# EAGLE design Button_Sequencer_single (EAGLE 9.3.0)
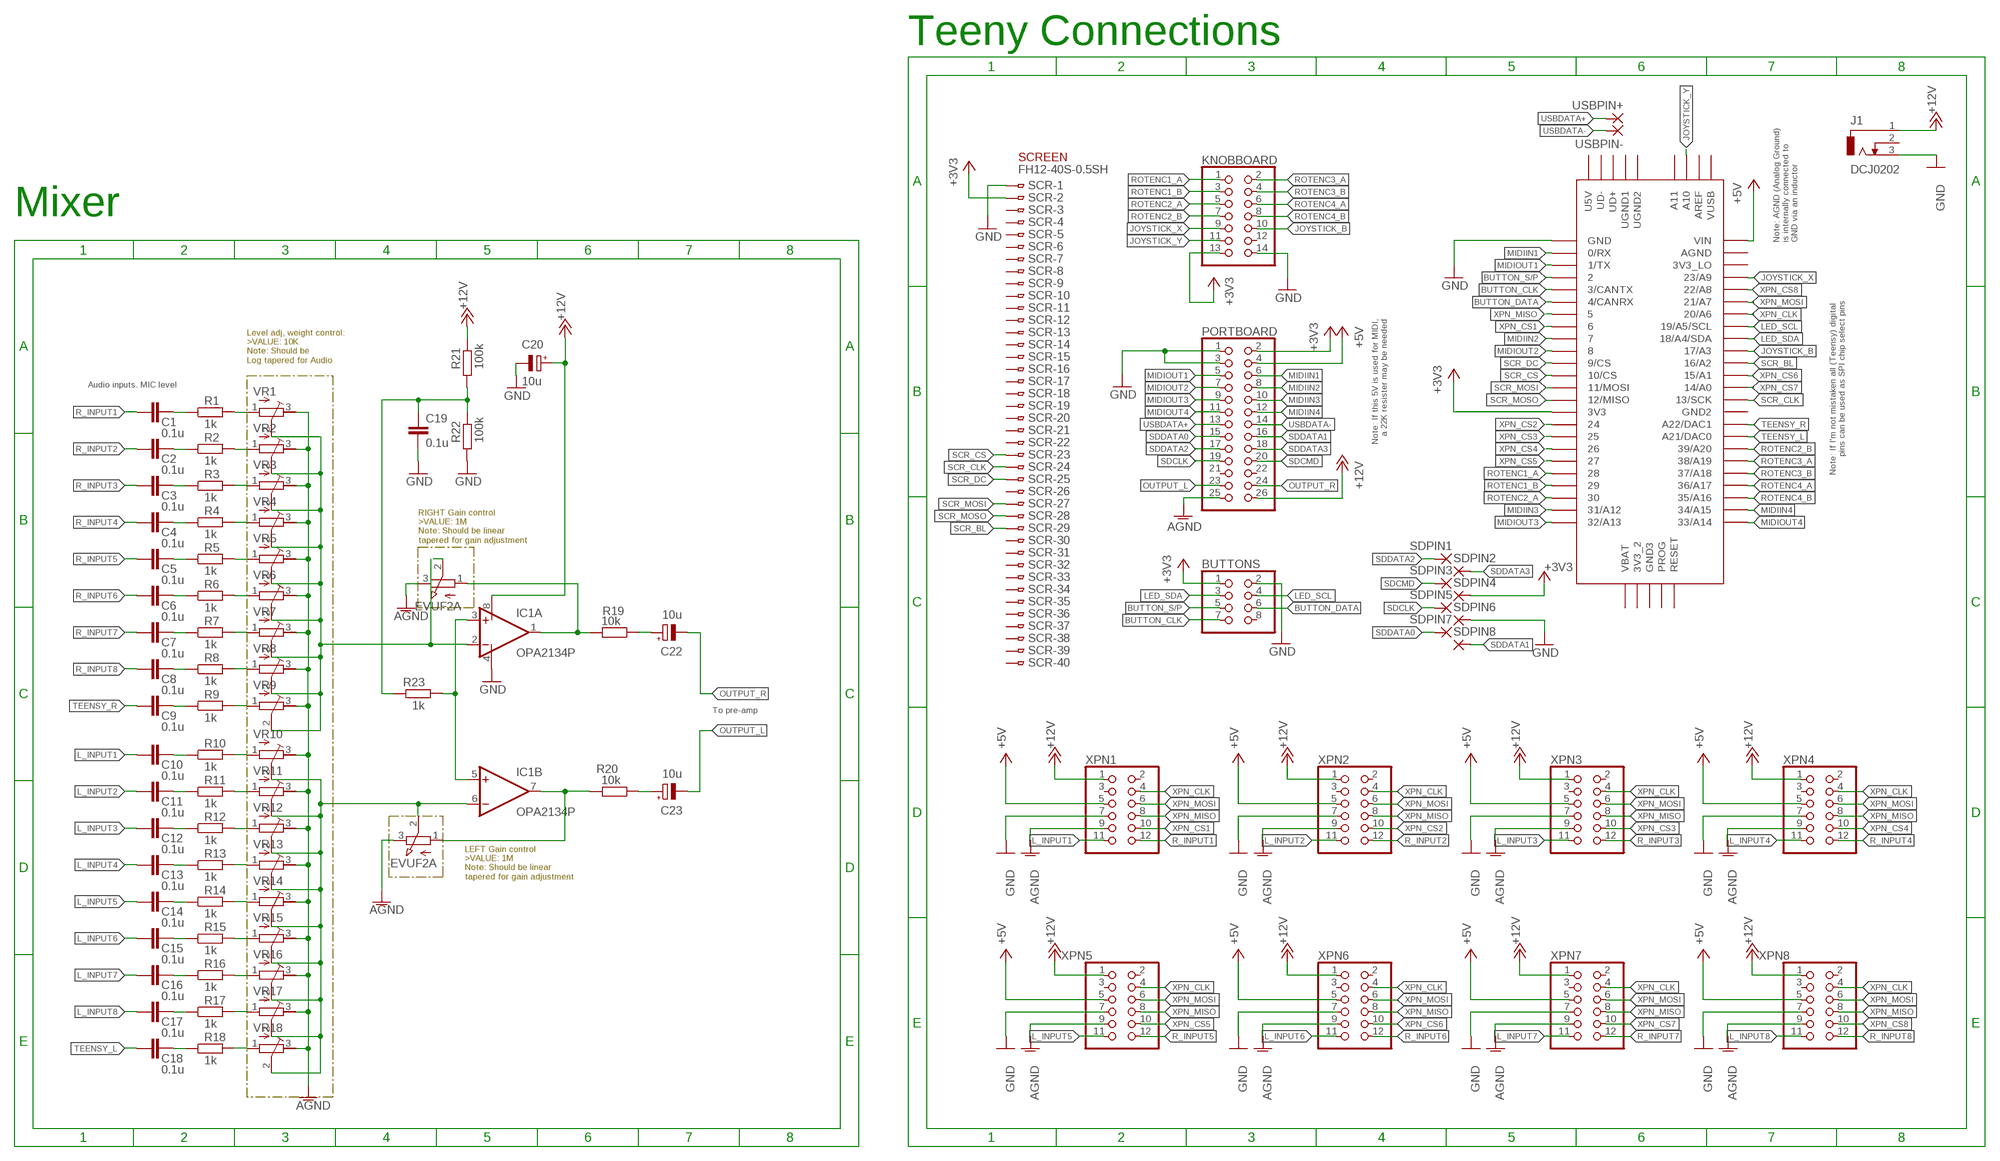
[diagram p0: schematic, sheet 1]

## Parts
BUTTONS  PINHD-2X4  [2X04]
C1  0.1u  C-EU025-030X050  [C025-030X050]
C2  0.1u  C-EU025-030X050  [C025-030X050]
C3  0.1u  C-EU025-030X050  [C025-030X050]
C4  0.1u  C-EU025-030X050  [C025-030X050]
C5  0.1u  C-EU025-030X050  [C025-030X050]
C6  0.1u  C-EU025-030X050  [C025-030X050]
C7  0.1u  C-EU025-030X050  [C025-030X050]
C8  0.1u  C-EU025-030X050  [C025-030X050]
C9  0.1u  C-EU025-030X050  [C025-030X050]
C10  0.1u  C-EU025-030X050  [C025-030X050]
C11  0.1u  C-EU025-030X050  [C025-030X050]
C12  0.1u  C-EU025-030X050  [C025-030X050]
C13  0.1u  C-EU025-030X050  [C025-030X050]
C14  0.1u  C-EU025-030X050  [C025-030X050]
C15  0.1u  C-EU025-030X050  [C025-030X050]
C16  0.1u  C-EU025-030X050  [C025-030X050]
C17  0.1u  C-EU025-030X050  [C025-030X050]
C18  0.1u  C-EU025-030X050  [C025-030X050]
C19  0.1u  C-EUC0805  [C0805]
C20  10u  CPOL-EUE5-10.5  [E5-10,5]
C22  10u  CPOL-EUE5-10.5  [E5-10,5]
C23  10u  CPOL-EUE5-10.5  [E5-10,5]
IC1  OPA2134P  [DIL08]
J1  DCJ0202  [DCJ0202]
KNOBBOARD  PINHD-2X7  [2X07]
PORTBOARD  PINHD-2X13  [2X13]
R1  1k  R-EU_R0805  [R0805]
R2  1k  R-EU_R0805  [R0805]
R3  1k  R-EU_R0805  [R0805]
R4  1k  R-EU_R0805  [R0805]
R5  1k  R-EU_R0805  [R0805]
R6  1k  R-EU_R0805  [R0805]
R7  1k  R-EU_R0805  [R0805]
R8  1k  R-EU_R0805  [R0805]
R9  1k  R-EU_R0805  [R0805]
R10  1k  R-EU_R0805  [R0805]
R11  1k  R-EU_R0805  [R0805]
R12  1k  R-EU_R0805  [R0805]
R13  1k  R-EU_R0805  [R0805]
R14  1k  R-EU_R0805  [R0805]
R15  1k  R-EU_R0805  [R0805]
R16  1k  R-EU_R0805  [R0805]
R17  1k  R-EU_R0805  [R0805]
R18  1k  R-EU_R0805  [R0805]
R19  10k  R-EU_R0805  [R0805]
R20  10k  R-EU_R0805  [R0805]
R21  100k  R-EU_R0805  [R0805]
R22  100k  R-EU_R0805  [R0805]
R23  1k  R-EU_R0805  [R0805]
SCR  FH12-40S-0.5SH  [FH12-40S-0.5SH]
SDPIN1  1,6/0,8  [1,6/0,8]
SDPIN2  1,6/0,8  [1,6/0,8]
SDPIN3  1,6/0,8  [1,6/0,8]
SDPIN4  1,6/0,8  [1,6/0,8]
SDPIN5  1,6/0,8  [1,6/0,8]
SDPIN6  1,6/0,8  [1,6/0,8]
SDPIN7  1,6/0,8  [1,6/0,8]
SDPIN8  1,6/0,8  [1,6/0,8]
TEENSY_3.6  TEENSY_3.5/3.6  [TEENSY_3.5/3.6]
USBPIN+  1,6/0,8  [1,6/0,8]
USBPIN-  1,6/0,8  [1,6/0,8]
VR1  R-TRIMM3339P  [RTRIM3339P]
VR2  R-TRIMM3339P  [RTRIM3339P]
VR3  R-TRIMM3339P  [RTRIM3339P]
VR4  R-TRIMM3339P  [RTRIM3339P]
VR5  R-TRIMM3339P  [RTRIM3339P]
VR6  R-TRIMM3339P  [RTRIM3339P]
VR7  R-TRIMM3339P  [RTRIM3339P]
VR8  R-TRIMM3339P  [RTRIM3339P]
VR9  R-TRIMM3339P  [RTRIM3339P]
VR10  R-TRIMM3339P  [RTRIM3339P]
VR11  R-TRIMM3339P  [RTRIM3339P]
VR12  R-TRIMM3339P  [RTRIM3339P]
VR13  R-TRIMM3339P  [RTRIM3339P]
VR14  R-TRIMM3339P  [RTRIM3339P]
VR15  R-TRIMM3339P  [RTRIM3339P]
VR16  R-TRIMM3339P  [RTRIM3339P]
VR17  R-TRIMM3339P  [RTRIM3339P]
VR18  R-TRIMM3339P  [RTRIM3339P]
VR19  EVUF2A  [EVUF]
VR20  EVUF2A  [EVUF]
XPN1  PINHD-2X6  [2X06]
XPN2  PINHD-2X6  [2X06]
XPN3  PINHD-2X6  [2X06]
XPN4  PINHD-2X6  [2X06]
XPN5  PINHD-2X6  [2X06]
XPN6  PINHD-2X6  [2X06]
XPN7  PINHD-2X6  [2X06]
XPN8  PINHD-2X6  [2X06]

## Nets
+3V3: BUTTONS.1 KNOBBOARD.13 PORTBOARD.2 SCR.2 SDPIN4.1(P) TEENSY_3.6.3V3
+5V: PORTBOARD.4 TEENSY_3.6.VIN XPN1.5 XPN2.5 XPN3.5 XPN4.5 XPN5.5 XPN6.5 XPN7.5 XPN8.5
+12V: C20.+ IC1.8(P:V+) J1.1 PORTBOARD.26 R21.2 XPN1.1 XPN2.1 XPN3.1 XPN4.1 XPN5.1 XPN6.1 XPN7.1 XPN8.1
AGND: PORTBOARD.25 VR1.3(E) VR2.3(E) VR3.3(E) VR4.3(E) VR5.3(E) VR6.3(E) VR7.3(E) VR8.3(E) VR9.3(E) VR10.3(E) VR11.3(E) VR12.3(E) VR13.3(E) VR14.3(E) VR15.3(E) VR16.3(E) VR17.3(E) VR18.3(E) VR19.3(E) VR20.3(E) XPN1.9 XPN2.9 XPN3.9 XPN4.9 XPN5.9 XPN6.9 XPN7.9 XPN8.9
BUTTON_CLK: BUTTONS.7 TEENSY_3.6.3/CANTX
BUTTON_DATA: BUTTONS.6 TEENSY_3.6.4/CANRX
BUTTON_S/P: BUTTONS.5 TEENSY_3.6.2
GND: BUTTONS.2 C19.2 C20.- IC1.4(P:V-) J1.3 KNOBBOARD.14 PORTBOARD.1 PORTBOARD.3 R22.1 SCR.1 SDPIN6.1(P) TEENSY_3.6.GND XPN1.7 XPN2.7 XPN3.7 XPN4.7 XPN5.7 XPN6.7 XPN7.7 XPN8.7
JOYSTICK_B: KNOBBOARD.10 TEENSY_3.6.17/A3
JOYSTICK_X: KNOBBOARD.9 TEENSY_3.6.23/A9
JOYSTICK_Y: KNOBBOARD.11 TEENSY_3.6.A10
L_INPUT1: C10.2 XPN1.11
L_INPUT2: C11.2 XPN2.11
L_INPUT3: C12.2 XPN3.11
L_INPUT4: C13.2 XPN4.11
L_INPUT5: C14.2 XPN5.11
L_INPUT6: C15.2 XPN6.11
L_INPUT7: C16.2 XPN7.11
L_INPUT8: C17.2 XPN8.11
L_OP_IN: IC1.6(B:-IN) VR10.2(S) VR11.2(S) VR12.2(S) VR13.2(S) VR14.2(S) VR15.2(S) VR16.2(S) VR17.2(S) VR18.2(S) VR20.2(S)
LED_SCL: BUTTONS.4 TEENSY_3.6.19/A5/SCL
LED_SDA: BUTTONS.3 TEENSY_3.6.18/A4/SDA
LEFT_OP_OUT: IC1.7(B:OUT) R20.2 VR20.1(A)
MIDIIN1: PORTBOARD.6 TEENSY_3.6.0/RX
MIDIIN2: PORTBOARD.8 TEENSY_3.6.7
MIDIIN3: PORTBOARD.10 TEENSY_3.6.31/A12
MIDIIN4: PORTBOARD.12 TEENSY_3.6.34/A15
MIDIOUT1: PORTBOARD.5 TEENSY_3.6.1/TX
MIDIOUT2: PORTBOARD.7 TEENSY_3.6.8
MIDIOUT3: PORTBOARD.9 TEENSY_3.6.32/A13
MIDIOUT4: PORTBOARD.11 TEENSY_3.6.33/A14
N$1: C4.1 R4.1
N$2: C22.+ R19.1
N$3: C1.1 R1.1
N$4: C2.1 R2.1
N$5: C3.1 R3.1
N$6: C9.1 R9.1
N$7: R9.2 VR9.1(A)
N$8: C10.1 R10.1
N$9: R10.2 VR10.1(A)
N$10: R3.2 VR3.1(A)
N$11: C11.1 R11.1
N$12: IC1.3(A:+IN) IC1.5(B:+IN) R23.1
N$13: R1.2 VR1.1(A)
N$14: R4.2 VR4.1(A)
N$15: C12.1 R12.1
N$16: C13.1 R13.1
N$17: R13.2 VR13.1(A)
N$18: R2.2 VR2.1(A)
N$19: C19.1 R21.1 R22.2 R23.2
N$20: C23.+ R20.1
N$21: R11.2 VR11.1(A)
N$23: R12.2 VR12.1(A)
N$25: C5.1 R5.1
N$26: C6.1 R6.1
N$27: C7.1 R7.1
N$28: R7.2 VR7.1(A)
N$29: R5.2 VR5.1(A)
N$30: R6.2 VR6.1(A)
N$31: C8.1 R8.1
N$32: R8.2 VR8.1(A)
N$35: C14.1 R14.1
N$36: R14.2 VR14.1(A)
N$39: C15.1 R15.1
N$40: C16.1 R16.1
N$41: C17.1 R17.1
N$42: R17.2 VR17.1(A)
N$43: R15.2 VR15.1(A)
N$44: R16.2 VR16.1(A)
N$45: C18.1 R18.1
N$46: R18.2 VR18.1(A)
OUTPUT_L: C23.- PORTBOARD.23
OUTPUT_R: C22.- PORTBOARD.24
R_INPUT1: C1.2 XPN1.12
R_INPUT2: C2.2 XPN2.12
R_INPUT3: C3.2 XPN3.12
R_INPUT4: C4.2 XPN4.12
R_INPUT5: C5.2 XPN5.12
R_INPUT6: C6.2 XPN6.12
R_INPUT7: C7.2 XPN7.12
R_INPUT8: C8.2 XPN8.12
R_OP_IN: IC1.2(A:-IN) VR1.2(S) VR2.2(S) VR3.2(S) VR4.2(S) VR5.2(S) VR6.2(S) VR7.2(S) VR8.2(S) VR9.2(S) VR19.2(S)
RIGHT_OP_OUT: IC1.1(A:OUT) R19.2 VR19.1(A)
ROTENC1_A: KNOBBOARD.1 TEENSY_3.6.28
ROTENC1_B: KNOBBOARD.3 TEENSY_3.6.29
ROTENC2_A: KNOBBOARD.5 TEENSY_3.6.30
ROTENC2_B: KNOBBOARD.7 TEENSY_3.6.39/A20
ROTENC3_A: KNOBBOARD.2 TEENSY_3.6.38/A19
ROTENC3_B: KNOBBOARD.4 TEENSY_3.6.37/A18
ROTENC4_A: KNOBBOARD.6 TEENSY_3.6.36/A17
ROTENC4_B: KNOBBOARD.8 TEENSY_3.6.35/A16
SCR_BL: SCR.29 TEENSY_3.6.16/A2
SCR_CLK: SCR.24 TEENSY_3.6.13/SCK
SCR_CS: SCR.23 TEENSY_3.6.10/CS
SCR_DC: SCR.25 TEENSY_3.6.9/CS
SCR_MOSI: SCR.27 TEENSY_3.6.11/MOSI
SCR_MOSO: SCR.28 TEENSY_3.6.12/MISO
SDCLK: PORTBOARD.19 SDPIN5.1(P)
SDCMD: PORTBOARD.20 SDPIN3.1(P)
SDDATA0: PORTBOARD.15 SDPIN7.1(P)
SDDATA1: PORTBOARD.16 SDPIN8.1(P)
SDDATA2: PORTBOARD.17 SDPIN1.1(P)
SDDATA3: PORTBOARD.18 SDPIN2.1(P)
TEENSY_L: C18.2 TEENSY_3.6.21/DAC0(A21/DAC0)
TEENSY_R: C9.2 TEENSY_3.6.A22/DAC1
USBDATA+: PORTBOARD.13 USBPIN+.1(P)
USBDATA-: PORTBOARD.14 USBPIN-.1(P)
XPN_CLK: TEENSY_3.6.20/A6 XPN1.4 XPN2.4 XPN3.4 XPN4.4 XPN5.4 XPN6.4 XPN7.4 XPN8.4
XPN_CS1: TEENSY_3.6.6 XPN1.10
XPN_CS2: TEENSY_3.6.24 XPN2.10
XPN_CS3: TEENSY_3.6.25 XPN3.10
XPN_CS4: TEENSY_3.6.26 XPN4.10
XPN_CS5: TEENSY_3.6.27 XPN5.10
XPN_CS6: TEENSY_3.6.15/A1 XPN6.10
XPN_CS7: TEENSY_3.6.14/A0 XPN7.10
XPN_CS8: TEENSY_3.6.22/A8 XPN8.10
XPN_MISO: TEENSY_3.6.5 XPN1.8 XPN2.8 XPN3.8 XPN4.8 XPN5.8 XPN6.8 XPN7.8 XPN8.8
XPN_MOSI: TEENSY_3.6.21/A7 XPN1.6 XPN2.6 XPN3.6 XPN4.6 XPN5.6 XPN6.6 XPN7.6 XPN8.6
Unconnected: BUTTONS.8 J1.2 KNOBBOARD.12 PORTBOARD.21 PORTBOARD.22 SCR.3 SCR.4 SCR.5 SCR.6 SCR.7 SCR.8 SCR.9 SCR.10 SCR.11 SCR.12 SCR.13 SCR.14 SCR.15 SCR.16 SCR.17 SCR.18 SCR.19 SCR.20 SCR.21 SCR.22 SCR.26 SCR.30 SCR.31 SCR.32 SCR.33 SCR.34 SCR.35 SCR.36 SCR.37 SCR.38 SCR.39 SCR.40 TEENSY_3.6.3V3_2 TEENSY_3.6.3V3_LO TEENSY_3.6.A11 TEENSY_3.6.AGND TEENSY_3.6.AREF TEENSY_3.6.GND2 TEENSY_3.6.GND3 TEENSY_3.6.PROG TEENSY_3.6.RESET TEENSY_3.6.U5V TEENSY_3.6.UD+ TEENSY_3.6.UD- TEENSY_3.6.UGND1 TEENSY_3.6.UGND2 TEENSY_3.6.VBAT TEENSY_3.6.VUSB XPN1.2 XPN1.3 XPN2.2 XPN2.3 XPN3.2 XPN3.3 XPN4.2 XPN4.3 XPN5.2 XPN5.3 XPN6.2 XPN6.3 XPN7.2 XPN7.3 XPN8.2 XPN8.3

## Notes on the sheet
- Teeny Connections
- SCREEN
- Mixer
- Note: AGND (Analog Ground) 
  is internally connected to 
  GND via an inductor
- Note: If I'm not mistaken all (Teensy) digital 
  pins can be used as SPI chip select pins
- Note: If this 5V is used for MIDI,
  a 22K resister may be needed
- Level adj, weight control:
  >VALUE: 10K
  Note: Should be
  Log tapered for Audio
- Audio inputs. MIC level
- RIGHT Gain control
  >VALUE: 1M
  Note: Should be linear
  tapered for gain adjustment
- To pre-amp
- LEFT Gain control
  >VALUE: 1M
  Note: Should be linear
  tapered for gain adjustment

## Library data of the parts
BUTTONS = pinhead:PINHD-2X4: PIN HEADER
C1-C19 = rcl:C-EU: CAPACITOR, European symbol; SPICEPREFIX: C
C20 C22 C23 = rcl:CPOL-EU: POLARIZED CAPACITOR, European symbol; SPICEPREFIX: C
IC1 = linear:OPA2134: SoundPLUS (TM) High Performance AUDIO OPERATIONAL AMPLIFIERS Source: http://focus.ti.com/lit/ds/sbos058/sbos058.pdf
J1 = con-jack:DCJ0202: DC POWER JACK Source: DCJ0202.pdf; OC_FARNELL: unknown; OC_NEWARK: unknown
KNOBBOARD = pinhead:PINHD-2X7: PIN HEADER
PORTBOARD = pinhead:PINHD-2X13: PIN HEADER
R1-R23 = rcl:R-EU_: RESISTOR, European symbol; SPICEPREFIX: R
SCR = con-hirose:FH12-40S-0.5S: 0.5mm Pitch Connectors For FPC/FFC Source: Data sheet <http://www.hirose.co.jp/cataloge_hp/e58605370.pdf>; MPN: FH12-40S-0.5SH(55); OC_FARNELL: 1324556; OC_NEWARK: 34M6178
SDPIN1-SDPIN8 USBPIN+ USBPIN- = wirepad:1,6/0,8: THROUGH-HOLE PAD
TEENSY_3.6 = Teensy356:TEENSY_3.5/3.6
VR1-VR18 = rcl:R-TRIMM: Trimm resistor; SPICEMODEL: X; SPICEPREFIXL: POT
VR19 VR20 = pot:EVU: 9 mm Square Rotary Potentiometers Source: Panasonic
XPN1-XPN8 = pinhead:PINHD-2X6: PIN HEADER

## Board
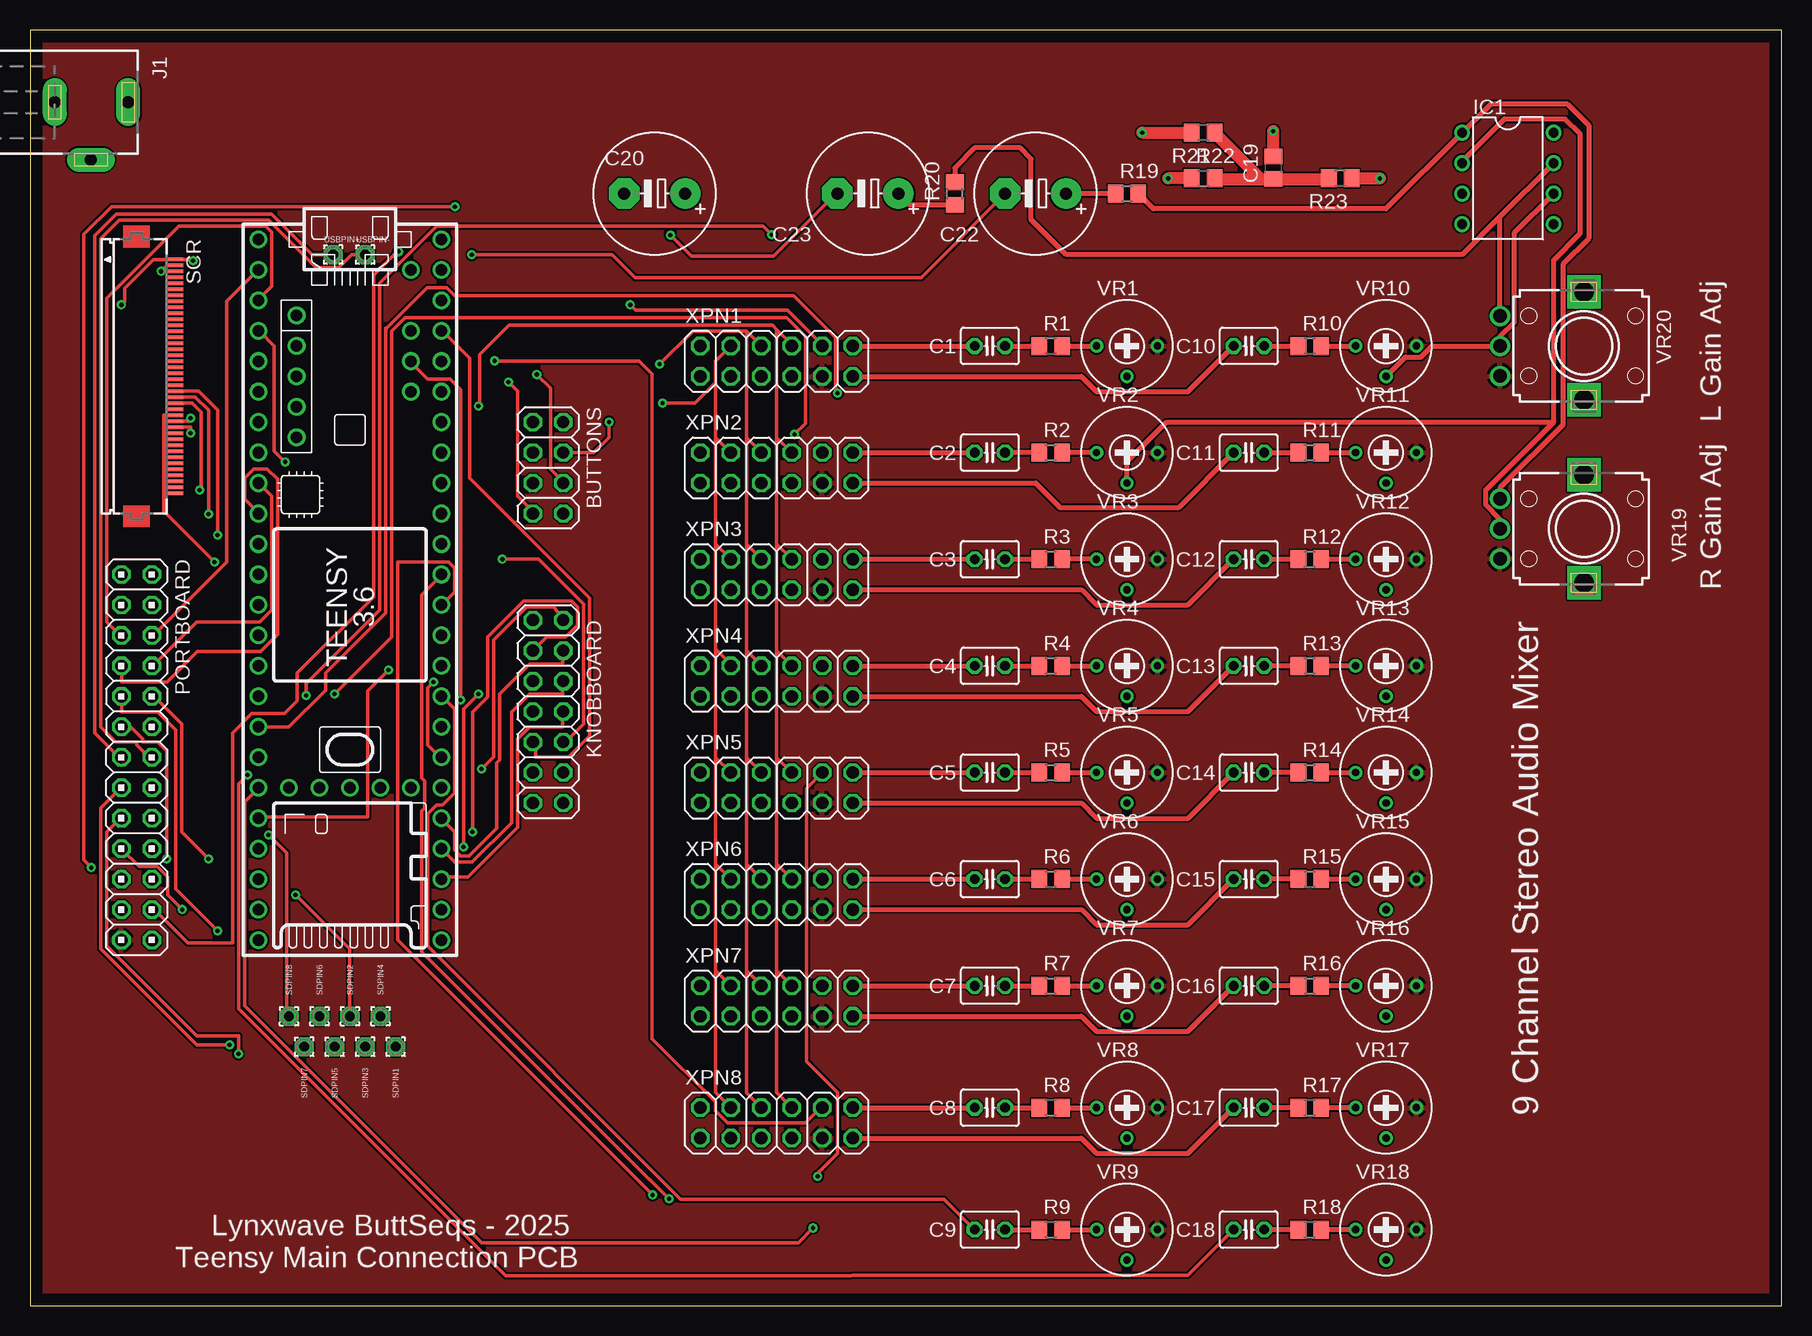
[diagram p1: board, top side]
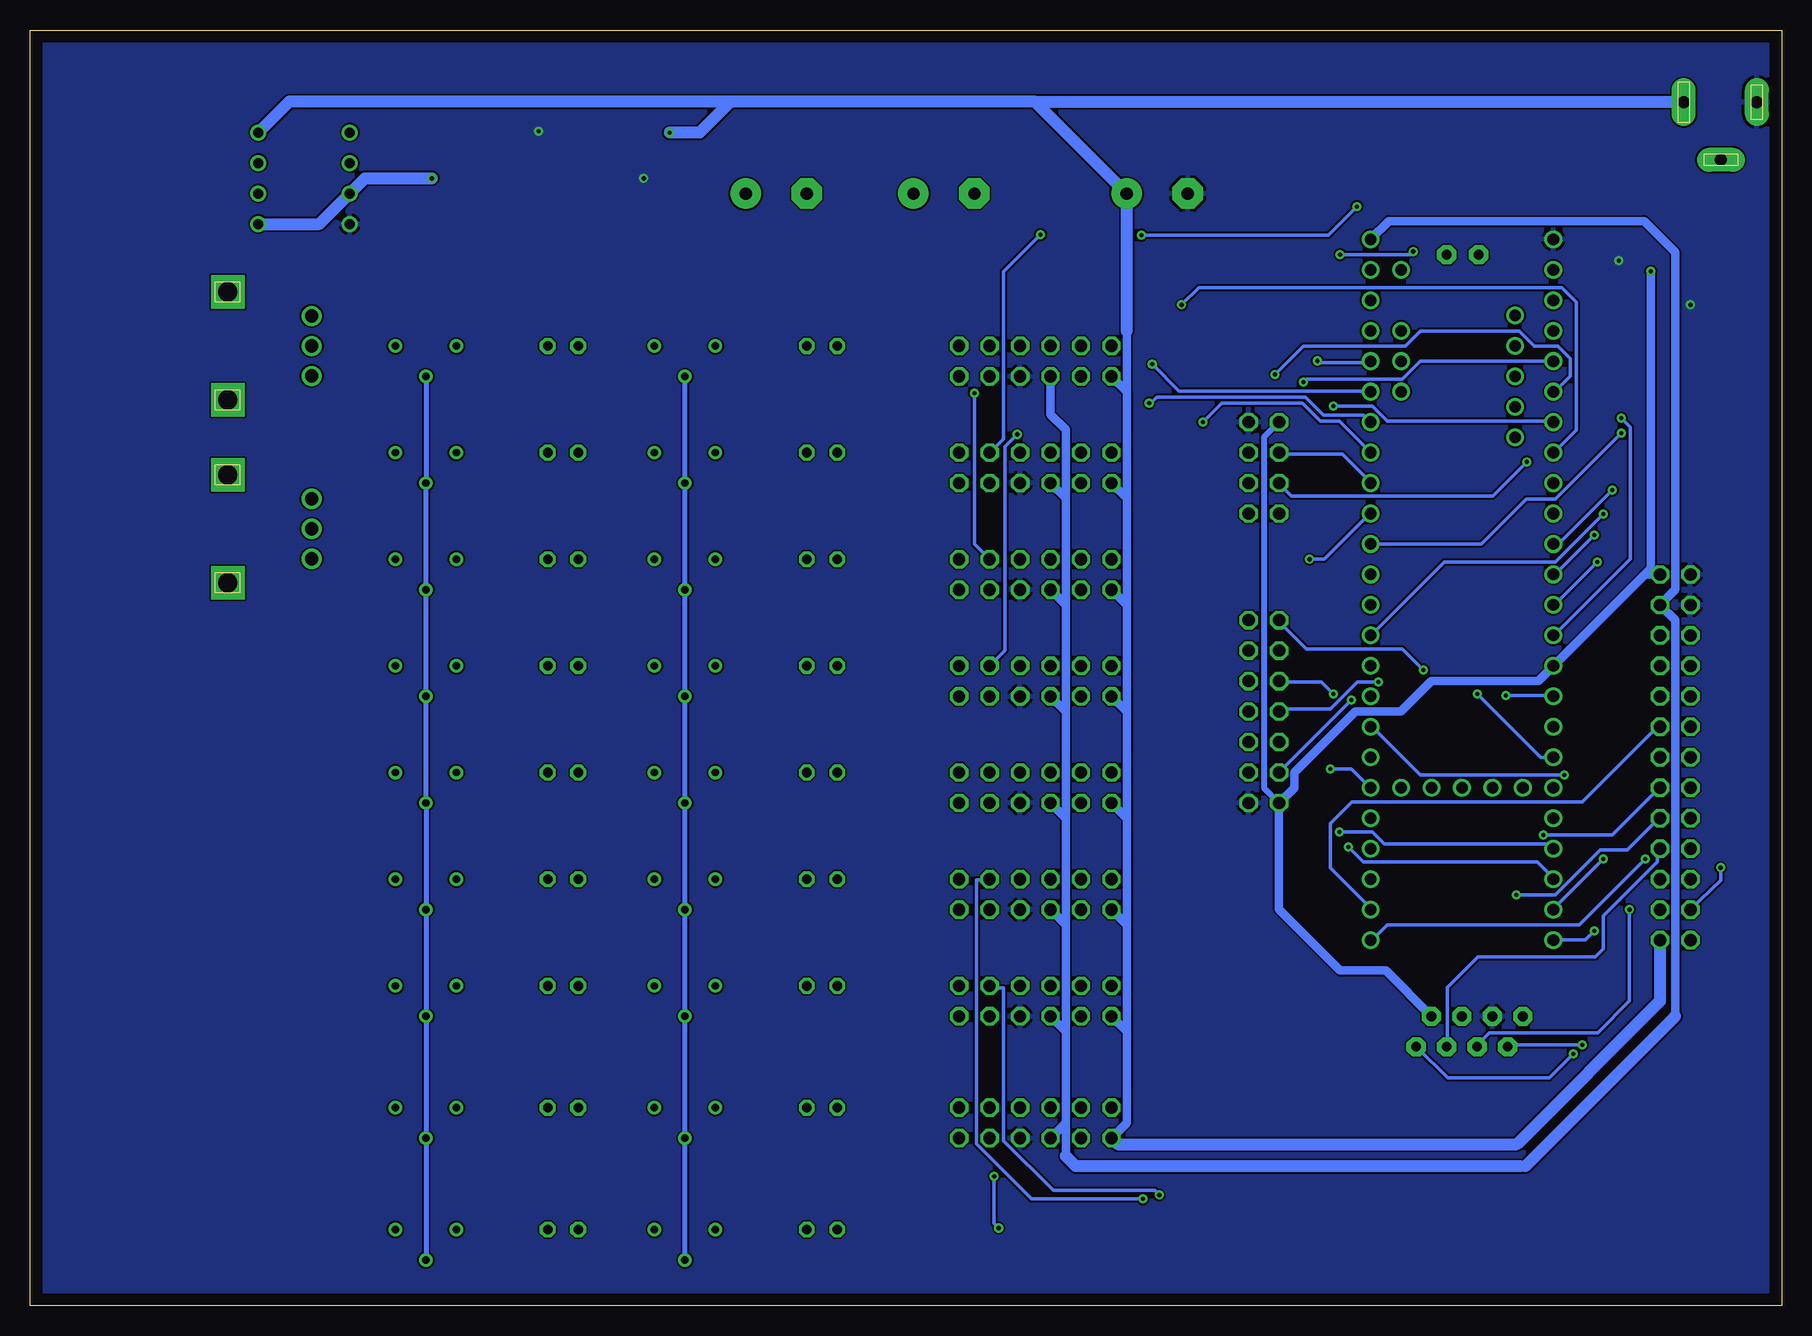
[diagram p2: board, bottom side, seen from below]

Size 146.03 x 106.35 mm. Coordinates in mm from the lower left corner, seen from the top.
Outline: 0,0 146.03,0 146.03,106.35 0,106.35 0,0
Copper layers (1*16): Top 0.035mm / dielectric 1.5mm / Bottom 0.035mm
Design rules "default *": minimum track width 0.3mm, minimum drill 0.35mm, track to track 6mil, track to pad 6mil, pad to pad 6mil, via to via 6mil, smd to smd 6mil, copper to edge 40mil, drill to drill 6mil, minimum pad ring 10mil, minimum via ring 8mil, stop-mask expansion 4mil, vias tented up to drill 0mil, thermal gap 10mil

### Footprints (pad centres in the part's own frame; a part is rotated, then mirrored left to right if it is on the bottom)
2X04 = drill 1.016 octagon: 1 -3.81,-1.27; 2 -3.81,1.27; 3 -1.27,-1.27; 4 -1.27,1.27; 5 1.27,-1.27; 6 1.27,1.27; 7 3.81,-1.27; 8 3.81,1.27
C025-030X050 = drill 0.813 octagon: 1 -1.27,0; 2 1.27,0
C0805 = smd 1.3 x 1.5: 1 -0.95,0; 2 0.95,0
E5-10,5 = drill 1.016 pad 2.54: + -2.54,0 | drill 1.016 pad 2.54 octagon: - 2.54,0
DIL08 = drill 0.813 pad 1.27: 1 -3.81,-3.81; 2 -1.27,-3.81; 3 1.27,-3.81; 4 3.81,-3.81; 5 3.81,3.81; 6 1.27,3.81; 7 -1.27,3.81; 8 -3.81,3.81
DCJ0202 = drill 1 pad 2 long: 1 0,3.1; 2 4.8,0; 3 0,-3
2X07 = drill 1.016 octagon: 1 -7.62,-1.27; 2 -7.62,1.27; 3 -5.08,-1.27; 4 -5.08,1.27; 5 -2.54,-1.27; 6 -2.54,1.27; 7 0,-1.27; 8 0,1.27; 9 2.54,-1.27; 10 2.54,1.27; 11 5.08,-1.27; 12 5.08,1.27; 13 7.62,-1.27; 14 7.62,1.27
2X13 = drill 1.016 octagon: 1 -15.24,-1.27; 2 -15.24,1.27; 3 -12.7,-1.27; 4 -12.7,1.27; 5 -10.16,-1.27; 6 -10.16,1.27; 7 -7.62,-1.27; 8 -7.62,1.27; 9 -5.08,-1.27; 10 -5.08,1.27; 11 -2.54,-1.27; 12 -2.54,1.27; 13 0,-1.27; 14 0,1.27; 15 2.54,-1.27; 16 2.54,1.27; 17 5.08,-1.27; 18 5.08,1.27; 19 7.62,-1.27; 20 7.62,1.27; 21 10.16,-1.27; 22 10.16,1.27; 23 12.7,-1.27; 24 12.7,1.27; 25 15.24,-1.27; 26 15.24,1.27
R0805 = smd 1.3 x 1.5: 1 -0.95,0; 2 0.95,0
FH12-40S-0.5SH = smd 0.3 x 1.3: 1 -9.75,3.25; 2 -9.25,3.25; 3 -8.75,3.25; 4 -8.25,3.25; 5 -7.75,3.25; 6 -7.25,3.25; 7 -6.75,3.25; 8 -6.25,3.25; 9 -5.75,3.25; 10 -5.25,3.25; 11 -4.75,3.25; 12 -4.25,3.25; 13 -3.75,3.25; 14 -3.25,3.25; 15 -2.75,3.25; 16 -2.25,3.25; 17 -1.75,3.25; 18 -1.25,3.25; 19 -0.75,3.25; 20 -0.25,3.25; 21 0.25,3.25; 22 0.75,3.25; 23 1.25,3.25; 24 1.75,3.25; 25 2.25,3.25; 26 2.75,3.25; 27 3.25,3.25; 28 3.75,3.25; 29 4.25,3.25; 30 4.75,3.25; 31 5.25,3.25; 32 5.75,3.25; 33 6.25,3.25; 34 6.75,3.25; 35 7.25,3.25; 36 7.75,3.25; 37 8.25,3.25; 38 8.75,3.25; 39 9.25,3.25; 40 9.75,3.25
1,6/0,8 = drill 0.813 pad 1.6 octagon: 1 0,0
TEENSY_3.5/3.6 = drill 0.965: 0/RX -25.4,-7.62; 1/TX -22.86,-7.62; 2 -20.32,-7.62; 3/CANTX -17.78,-7.62; 3V3 7.62,-7.62; 3V3_2 17.78,-2.54; 3V3_LO -22.86,7.62; 4/CANRX -15.24,-7.62; 5 -12.7,-7.62; 6 -10.16,-7.62; 7 -7.62,-7.62; 8 -5.08,-7.62; 9/CS -2.54,-7.62; 10/CS 0,-7.62; 11/MOSI 2.54,-7.62; 12/MISO 5.08,-7.62; 13/SCK 5.08,7.62; 14/A0 2.54,7.62; 15/A1 0,7.62; 16/A2 -2.54,7.62; 17/A3 -5.08,7.62; 18/A4/SDA -7.62,7.62; 19/A5/SCL -10.16,7.62; 20/A6 -12.7,7.62; 21/A7 -15.24,7.62; 21/DAC0 12.7,7.62; 22/A8 -17.78,7.62; 23/A9 -20.32,7.62; 24 10.16,-7.62; 25 12.7,-7.62; 26 15.24,-7.62; 27 17.78,-7.62; 28 20.32,-7.62; 29 22.86,-7.62; 30 25.4,-7.62; 31/A12 27.94,-7.62; 32/A13 30.48,-7.62; 33/A14 30.48,7.62; 34/A15 27.94,7.62; 35/A16 25.4,7.62; 36/A17 22.86,7.62; 37/A18 20.32,7.62; 38/A19 17.78,7.62; 39/A20 15.24,7.62; A10 -17.78,5.08; A11 -15.24,5.08; A22/DAC1 10.16,7.62; AGND -25.4,7.62; AREF -20.32,5.08; GND -27.94,-7.62; GND2 7.62,7.62; GND3 17.78,0; PROG 17.78,2.54; RESET 17.78,5.08; U5V -21.59,-4.445; UD+ -16.51,-4.445; UD- -19.05,-4.445; UGND1 -13.97,-4.445; UGND2 -11.43,-4.445; VBAT 17.78,-5.08; VIN -27.94,7.62; VUSB -25.4,5.08
RTRIM3339P = drill 0.61: 1 -2.54,0; 2 0,-2.54; 3 2.54,0
EVUF = drill 1.1 pad 1.676: 1 -2.5,-7; 2 0,-7; 3 2.5,-7 | drill 1.6 pad 2.8 square: M1 4.5,0; M2 -4.5,0
2X06 = drill 1.016 octagon: 1 -6.35,-1.27; 2 -6.35,1.27; 3 -3.81,-1.27; 4 -3.81,1.27; 5 -1.27,-1.27; 6 -1.27,1.27; 7 1.27,-1.27; 8 1.27,1.27; 9 3.81,-1.27; 10 3.81,1.27; 11 6.35,-1.27; 12 6.35,1.27

### Placement (x,y rotation side)
BUTTONS  43.18,69.85 270 top
C1  80.01,80.01 180 top
C2  80.01,71.12 180 top
C3  80.01,62.23 180 top
C4  80.01,53.34 180 top
C5  80.01,44.45 180 top
C6  80.01,35.56 180 top
C7  80.01,26.67 180 top
C8  80.01,16.51 180 top
C9  80.01,6.35 180 top
C10  101.6,80.01 180 top
C11  101.6,71.12 180 top
C12  101.6,62.23 180 top
C13  101.6,53.34 180 top
C14  101.6,44.45 180 top
C15  101.6,35.56 180 top
C16  101.6,26.67 180 top
C17  101.6,16.51 180 top
C18  101.6,6.35 180 top
C19  103.63,94.87 90 top
C20  52.07,92.71 180 top
C22  83.82,92.71 180 top
C23  69.85,92.71 180 top
IC1  123.19,93.98 270 top
J1  5.08,100.33 270 top
KNOBBOARD  43.18,49.53 270 top
PORTBOARD  8.89,45.72 270 top
R1  85.09,80.01 0 top
R2  85.09,71.12 0 top
R3  85.09,62.23 0 top
R4  85.09,53.34 0 top
R5  85.09,44.45 0 top
R6  85.09,35.56 0 top
R7  85.09,26.67 0 top
R8  85.09,16.51 0 top
R9  85.09,6.35 0 top
R10  106.68,80.01 0 top
R11  106.68,71.12 0 top
R12  106.68,62.23 0 top
R13  106.68,53.34 0 top
R14  106.68,44.45 0 top
R15  106.68,35.56 0 top
R16  106.68,26.67 0 top
R17  106.68,16.51 0 top
R18  106.68,6.35 0 top
R19  91.44,92.71 0 top
R20  77.09,92.71 90 top
R21  97.79,97.79 180 top
R22  97.79,93.98 0 top
R23  109.22,93.98 180 top
SCR  8.89,77.47 270 top
SDPIN1  30.48,21.59 270 top
SDPIN2  26.67,24.13 90 top
SDPIN3  27.94,21.59 270 top
SDPIN4  29.21,24.13 90 top
SDPIN5  25.4,21.59 270 top
SDPIN6  24.13,24.13 90 top
SDPIN7  22.86,21.59 270 top
SDPIN8  21.59,24.13 90 top
TEENSY_3.6  26.67,60.96 270 top
USBPIN+  25.27,87.63 0 top
USBPIN-  27.94,87.63 0 top
VR1  91.44,80.01 0 top
VR2  91.44,71.12 0 top
VR3  91.44,62.23 0 top
VR4  91.44,53.34 0 top
VR5  91.44,44.45 0 top
VR6  91.44,35.56 0 top
VR7  91.44,26.67 0 top
VR8  91.44,16.51 0 top
VR9  91.44,6.35 0 top
VR10  113.03,80.01 0 top
VR11  113.03,71.12 0 top
VR12  113.03,62.23 0 top
VR13  113.03,53.34 0 top
VR14  113.03,44.45 0 top
VR15  113.03,35.56 0 top
VR16  113.03,26.67 0 top
VR17  113.03,16.51 0 top
VR18  113.03,6.35 0 top
VR19  129.54,64.77 270 top
VR20  129.54,80.01 270 top
XPN1  62.23,78.74 0 top
XPN2  62.23,69.85 0 top
XPN3  62.23,60.96 0 top
XPN4  62.23,52.07 0 top
XPN5  62.23,43.18 0 top
XPN6  62.23,34.29 0 top
XPN7  62.23,25.4 0 top
XPN8  62.23,15.24 0 top

### Tracks (layer width: path | path; a pad name or v marks a point on that pad's centre or on a via)
+3V3  (via drill 0.35)
  Top 0.3: SCR.2 11.43,86.72 | 11.43,86.72 11.41,86.72 | 11.43,86.72 11.38,86.67 11.37,86.67 v10.92,86.23
  Bottom 0.5: BUTTONS.1 43.17,72.4 43.17,43.17 KNOBBOARD.13
  Bottom 0.7: SDPIN4.1 33.02,27.94 36.83,27.94 41.91,33.02 KNOBBOARD.13 40.64,43.18 40.64,44.45 35.56,49.53 31.75,49.53 29.21,52.07 20.32,52.07 TEENSY_3.6.3V3 11.43,60.96 | 11.43,60.96 PORTBOARD.2 | 11.43,60.96 10.92,61.47 v10.92,86.23
+5V
  Bottom 0.7: XPN8.5 59.69,15.24 | 59.69,15.24 59.69,22.86 | 59.69,22.86 59.69,31.75 | 59.69,31.75 59.69,40.64 | 59.69,40.64 59.69,49.53 | 59.69,49.53 59.69,58.42 | 59.69,58.42 59.69,67.31 | 59.69,67.31 59.69,73.03 60.96,74.3 XPN1.5 | XPN2.5 59.69,67.31 | XPN3.5 59.69,58.42 | XPN4.5 59.69,49.53 | XPN5.5 59.69,40.64 | XPN6.5 59.69,31.75 | XPN7.5 59.69,22.86 | TEENSY_3.6.VIN 32.77,90.42 11.48,90.42 8.89,87.83 8.89,59.69 PORTBOARD.4 8.89,57.15 8.89,24.13 | 59.69,12.46 59.69,15.24 | 21.38,11.64 22.86,11.64
  Bottom 1: 21.82,11.64 22.86,11.64 58.86,11.64 59.69,12.46 | 8.89,24.13 21.38,11.64
+12V  (via drill 0.35)
  Top 1: v92.71,97.79 R21.2
  Bottom 0.7: XPN1.1 54.61,76.2 | 54.61,76.2 54.61,67.31 | 54.61,67.31 54.61,58.42 | 54.61,58.42 54.61,49.53 | 54.61,49.53 54.61,40.64 | 54.61,40.64 54.61,31.75 | 54.61,31.75 54.61,22.86 | 54.61,22.86 54.61,15.24 XPN8.1 | XPN7.1 54.61,22.86 | XPN6.1 54.61,31.75 | XPN5.1 54.61,40.64 | XPN4.1 54.61,49.53 | XPN3.1 54.61,58.42 | XPN2.1 54.61,67.31 | 54.61,76.2 54.61,81.28
  Bottom 1: 62.27,100.37 C20.+ 54.61,81.28 | IC1.8 124.42,100.37 87.63,100.37 | 62.27,100.37 87.63,100.37 | PORTBOARD.26 10.16,25.4 22.1,13.46 55.37,13.46 XPN8.1 | 62.27,100.37 8.22,100.37 J1.1 | 87.63,100.37 90.21,97.79 v92.71,97.79
AGND
  pour Top: -5.08,-1.27 -5.08,106.68 149.86,106.68 149.86,-1.27
BUTTON_CLK  (via drill 0.35)
  Top 0.3: v39.88,77 40.63,76.25 40.63,67.5 41.88,66.25 BUTTONS.7
  Bottom 0.3: v39.88,77 39.63,77.25 31.63,77.25 30.13,78.75 19.13,78.75 TEENSY_3.6.3/CANTX
BUTTON_DATA  (via drill 0.35)
  Top 0.3: v42.25,77.64 43.38,76.5 43.38,69.75 44.38,68.75 BUTTONS.6
  Bottom 0.3: v42.25,77.64 39.88,80 31.38,80 30.13,81.25 21.88,81.25 20.63,80 18.66,80 17.63,78.97 17.63,77.5 18.88,76.25 TEENSY_3.6.4/CANRX
BUTTON_S/P  (via drill 0.35)
  Top 0.3: v21.26,70.34 20.37,71.23 20.37,80.01 19.13,81.25 TEENSY_3.6.2
  Bottom 0.3: v21.26,70.34 24.11,67.5 40.88,67.5 41.88,68.5 BUTTONS.5
GND  (via drill 0.35)
  Top 0.3: v13.59,87.12 13.49,87.22 SCR.1 10.26,87.22 7.88,84.83 7.88,83.69 v7.62,83.44
  Top 1: C19.2 v103.63,97.92 | R22.1 v94.87,93.98
  pour Bottom: -2.54,105.41 147.32,105.41 147.32,-3.81 -2.54,-3.81
JOYSTICK_B  (via drill 0.35)
  Top 0.3: KNOBBOARD.10 44.63,47 46.13,48.5 46.13,58.5 42.4,62.23 v39.37,62.23
  Bottom 0.3: TEENSY_3.6.17/A3 34.38,66 38.15,62.23 v39.37,62.23
JOYSTICK_X
  Top 0.3: TEENSY_3.6.23/A9 34.38,81.25 36.63,79 36.63,69 46.63,59 46.63,47.5 44.88,45.75 42.13,45.75 42.13,46.75 KNOBBOARD.9
JOYSTICK_Y  (via drill 0.35)
  Top 0.3: v35.88,50.5 35.88,76.39 35.02,77.25 33.13,77.25 31.88,78.5 TEENSY_3.6.A10
  Bottom 0.3: v35.88,50.5 41.88,44.5 KNOBBOARD.11
L_INPUT1
  Top 0.42: XPN1.11 87.63,77.47 88.9,76.2 96.52,76.2 C10.2
L_INPUT2
  Top 0.42: XPN2.11 83.82,68.58 85.85,66.55 95.76,66.55 C11.2
L_INPUT3
  Top 0.42: XPN3.11 87.63,59.69 88.9,58.42 96.52,58.42 C12.2
L_INPUT4
  Top 0.42: XPN4.11 87.63,50.8 88.9,49.53 96.52,49.53 C13.2
L_INPUT5
  Top 0.42: XPN5.11 87.63,41.91 88.9,40.64 96.52,40.64 C14.2
L_INPUT6
  Top 0.42: XPN6.11 87.63,33.02 88.9,31.75 96.52,31.75 C15.2
L_INPUT7
  Top 0.42: XPN7.11 87.63,24.13 88.9,22.86 96.52,22.86 C16.2
L_INPUT8
  Top 0.42: XPN8.11 87.63,13.97 88.9,12.7 96.52,12.7 C17.2
L_OP_IN
  Top 0.42: IC1.6 123.74,89.45 123.74,82.01 122.54,80.81 VR20.2 116.87,80.01 115.95,79.09 114.65,79.09 VR10.2
  Bottom 0.42: VR10.2 VR11.2 VR12.2 VR13.2 VR14.2 VR15.2 VR16.2 VR17.2 VR18.2
LED_SCL  (via drill 0.35)
  Top 0.3: BUTTONS.4 46.99,71.12 48.26,72.39 v48.26,73.66
  Bottom 0.3: TEENSY_3.6.19/A5/SCL 34.38,71.25 36.88,73.75 38.48,73.75 39.98,75.26 46.66,75.26 v48.26,73.66
LED_SDA
  Bottom 0.3: TEENSY_3.6.18/A4/SDA 34.38,68.75 36.63,71 41.88,71 BUTTONS.3
LEFT_OP_OUT
  Top 0.42: VR20.1 122.54,90.79 | 122.54,90.79 IC1.7 | 122.54,90.79 119.38,87.63 86.36,87.63 83.46,90.53 83.46,95.61 82.55,96.52 78.74,96.52 77.09,94.87 R20.2
MIDIIN1
  Top 0.3: TEENSY_3.6.0/RX 18.88,86.25 16.38,83.75 16.38,62 10.38,56 PORTBOARD.6
MIDIIN2
  Top 0.3: TEENSY_3.6.7 20.13,67.5 20.13,58 19.13,57 13.88,57 10.38,53.5 PORTBOARD.8
MIDIIN3  (via drill 0.35)
  Top 0.3: v14.88,37.25 12.63,39.5 12.63,48.5 10.38,50.75 PORTBOARD.10
  Bottom 0.3: v14.88,37.25 18.88,33.25 TEENSY_3.6.31/A12
MIDIIN4
  Bottom 0.3: TEENSY_3.6.34/A15 34.38,33.25 37.63,36.5 37.63,40.22 35.85,42 16.63,42 10.38,48.25 PORTBOARD.12
MIDIOUT1
  Top 0.3: TEENSY_3.6.1/TX 19.13,84 20.13,85 20.13,89.5 19.63,90 12.4,90 6.38,83.98 6.38,57 7.38,56 PORTBOARD.5
MIDIOUT2
  Top 0.3: TEENSY_3.6.8 18.88,66.25 17.88,67.25 17.88,69 18.63,69.75 19.79,69.75 20.63,68.91 20.63,55.94 19.21,54.52 13.95,54.52 11.43,52 7.63,52 7.63,53.25 PORTBOARD.7
MIDIOUT3  (via drill 0.35)
  Top 0.3: v15.63,31.25 12.13,34.75 12.13,48 10.63,49.5 7.63,49.5 7.63,50.75 PORTBOARD.9
  Bottom 0.3: TEENSY_3.6.32/A13 16.39,30.49 v15.63,31.25
MIDIOUT4  (via drill 0.35)
  Top 0.3: v11.38,37.25 11.38,46.25 10.63,47 9.38,47 9.38,47.25 8.38,48.25 PORTBOARD.11
  Bottom 0.3: v11.38,37.25 16.88,31.75 32.88,31.75 34.13,30.5 TEENSY_3.6.33/A14
N$1
  Top 0.42: C4.1 R4.1
N$2
  Top 0.42: R19.1 C22.+
N$3
  Top 0.42: C1.1 R1.1
N$4
  Top 0.42: R2.1 C2.1
N$5
  Top 0.42: C3.1 R3.1
N$6
  Top 0.42: C9.1 R9.1
N$7
  Top 0.42: R9.2 VR9.1
N$8
  Top 0.42: C10.1 R10.1
N$9
  Top 0.42: R10.2 VR10.1
N$10
  Top 0.42: VR3.1 R3.2
N$11
  Top 0.42: C11.1 R11.1
N$12  (via drill 0.35)
  Top 0.3: 119.38,92.75 IC1.3
  Top 1: R23.1 v112.52,93.98
  Bottom 1: v112.52,93.98 118.11,93.98 IC1.3 121.92,90.17 IC1.5
N$13
  Top 0.42: R1.2 VR1.1
N$14
  Top 0.42: R4.2 VR4.1
N$15
  Top 0.42: C12.1 R12.1
N$16
  Top 0.42: R13.1 C13.1
N$17
  Top 0.42: VR13.1 R13.2
N$18
  Top 0.42: VR2.1 R2.2
N$19
  Top 1: R22.2 98.8,93.92 C19.1 | C19.1 108.21,93.92 R23.2 | R21.1 102.61,93.92 C19.1
N$20
  Top 0.42: R20.1 73.34,91.76 C23.+
N$21
  Top 0.42: R11.2 VR11.1
N$23
  Top 0.42: R12.2 VR12.1
N$25
  Top 0.42: C5.1 R5.1
N$26
  Top 0.42: C6.1 R6.1
N$27
  Top 0.42: C7.1 R7.1
N$28
  Top 0.42: R7.2 VR7.1
N$29
  Top 0.42: R5.2 VR5.1
N$30
  Top 0.42: R6.2 VR6.1
N$31
  Top 0.42: C8.1 R8.1
N$32
  Top 0.42: R8.2 VR8.1
N$35
  Top 0.42: R14.1 C14.1
N$36
  Top 0.42: 107.91,44.17 R14.2 VR14.1
N$39
  Top 0.42: R15.1 C15.1
N$40
  Top 0.42: R16.1 C16.1
N$41
  Top 0.42: R17.1 C17.1
N$42
  Top 0.42: 107.91,16.23 R17.2 VR17.1
N$43
  Top 0.42: R15.2 VR15.1
N$44
  Top 0.42: VR16.1 R16.2
N$45
  Top 0.42: R18.1 C18.1
N$46
  Top 0.42: VR18.1 R18.2
OUTPUT_L  (via drill 0.35)
  Top 0.3: C23.- 67.18,92.71 61.98,87.5 55.13,87.5 v53.38,89.25 | v35.42,91.63 6.79,91.63 4.47,89.31 4.47,37.16 v5.11,36.52
  Bottom 0.3: v5.11,36.52 5.09,36.5 5.09,35.44 PORTBOARD.23 | v35.42,91.63 37.8,89.25 v53.38,89.25
OUTPUT_R  (via drill 0.35)
  Top 0.3: C22.- 74.3,85.72 50.42,85.72 48.52,87.63 v36.83,87.63 | PORTBOARD.24 10.38,33 13.13,30.25 16.88,30.25 16.88,47.75 18.5,49.37 21.21,49.37 22.27,50.43 22.27,52.73 28.63,59.09 28.63,85.9 30.62,87.88 v30.73,87.88
  Bottom 0.3: v36.83,87.63 30.99,87.63 v30.73,87.88
R_INPUT1
  Top 0.42: XPN1.12 C1.2
R_INPUT2
  Top 0.42: XPN2.12 C2.2
R_INPUT3
  Top 0.42: XPN3.12 C3.2
R_INPUT4
  Top 0.42: XPN4.12 C4.2
R_INPUT5
  Top 0.42: XPN5.12 C5.2
R_INPUT6
  Top 0.42: XPN6.12 C6.2
R_INPUT7
  Top 0.42: XPN7.12 C7.2
R_INPUT8
  Top 0.42: XPN8.12 C8.2
R_OP_IN
  Top 0.42: VR19.2 122.54,65.57 121.34,66.77 121.34,68 127,73.66 | 127,73.66 127,87.18 129.22,89.4 129.22,97.66 127.95,98.93 122.89,98.93 119.38,95.43 IC1.2 | VR2.2 91.44,70.36 94.74,73.66 127,73.66
  Bottom 0.42: VR9.2 VR8.2 VR7.2 VR6.2 VR5.2 VR4.2 VR3.2 VR2.2 VR1.2
RIGHT_OP_OUT
  Top 0.42: R19.2 93.66,91.44 113.03,91.44 IC1.1 121.79,100.2 128.14,100.2 129.92,98.42 129.92,88.97 127.78,86.82 127.78,73.43 122.54,68.19 VR19.1
ROTENC1_A  (via drill 0.35)
  Top 0.3: v29.88,53 28.13,51.25 28.13,40.75 19.13,40.75 TEENSY_3.6.28
  Bottom 0.3: v29.88,53 31.63,54.75 39.63,54.75 41.88,57 KNOBBOARD.1
ROTENC1_B  (via drill 0.35)
  Top 0.3: v36.88,39.5 36.88,49.5 38.13,50.75 38.13,55.75 41.13,58.75 45.13,58.75 45.63,58.25 45.63,56.75 44.63,55.75 43.05,55.75 KNOBBOARD.3
  Bottom 0.3: v36.88,39.5 34.13,39.5 33.13,38.5 19.38,38.5 19.13,38.25 TEENSY_3.6.29
ROTENC2_A  (via drill 0.35)
  Top 0.3: v36.13,38.25 36.13,49.75 v37.38,51
  Bottom 0.3: v36.13,38.25 34.88,37 20.38,37 19.13,35.75 TEENSY_3.6.30 | v37.38,51 38.38,52 41.88,52 KNOBBOARD.5
ROTENC2_B  (via drill 0.35)
  Top 0.3: v33.63,52 33.13,51.5 33.13,46.75 34.13,45.75 TEENSY_3.6.39/A20
  Bottom 0.3: v33.63,52 35.38,52 37.63,49.75 41.88,49.75 KNOBBOARD.7
ROTENC3_A  (via drill 0.35)
  Top 0.3: v37.63,44.75 38.63,45.75 38.63,55.5 41.38,58.25 43.68,58.25 KNOBBOARD.2
  Bottom 0.3: v37.63,44.75 35.88,44.75 34.38,43.25 TEENSY_3.6.38/A19
ROTENC3_B
  Top 0.3: TEENSY_3.6.37/A18 34.38,40.5 35.38,39.5 35.38,38 35.88,37.5 36.61,37.5 38.88,39.77 38.88,45.25 39.13,45.5 39.13,51 41.63,53.5 44.38,53.5 44.38,54.5 KNOBBOARD.4
ROTENC4_A
  Top 0.3: TEENSY_3.6.36/A17 34.38,38 35.38,37 36.87,37 40.13,40.26 40.13,49.5 41.63,51 44.38,51 44.38,52 KNOBBOARD.6
ROTENC4_B
  Top 0.3: TEENSY_3.6.35/A16 34.38,35.75 36.51,35.75 40.63,39.87 40.63,47.25 41.63,48.25 44.38,48.25 44.38,49.5 KNOBBOARD.8
SCR_BL  (via drill 0.35)
  Top 0.3: v13.38,72.75 13.38,73.25 12.38,73.25 SCR.29
  Bottom 0.3: v13.38,72.75 18.88,67.25 21.32,67.25 25.07,63.5 TEENSY_3.6.16/A2
SCR_CLK  (via drill 0.35)
  Top 0.3: v14.88,66 14.88,74.66 13.79,75.75 12.38,75.75 SCR.24
  Bottom 0.3: v14.88,66 18.88,62 28.13,62 34.13,56 TEENSY_3.6.13/SCK
SCR_CS  (via drill 0.35)
  Top 0.3: v15.63,64.25 15.63,74.67 14.05,76.25 12.38,76.25 SCR.23
  Bottom 0.3: v15.63,64.25 18.88,61 TEENSY_3.6.10/CS
SCR_DC  (via drill 0.35)
  Top 0.3: v14.13,68 14.26,68.13 14.26,74.52 13.52,75.25 12.38,75.25 SCR.25
  Bottom 0.3: v14.13,68 18.63,63.5 TEENSY_3.6.9/CS
SCR_MOSI  (via drill 0.35)
  Top 0.3: v15.38,62 11.13,66.25 11.13,74.25 12.13,74.25 SCR.27
  Bottom 0.3: v15.38,62 18.88,58.5 TEENSY_3.6.11/MOSI
SCR_MOSO  (via drill 0.35)
  Top 0.3: v13.38,74 13.38,73.75 12.38,73.75 SCR.28
  Bottom 0.3: v13.38,74 12.63,73.25 12.63,62.25 18.88,56 TEENSY_3.6.12/MISO
SDCLK  (via drill 0.35)
  Top 0.3: PORTBOARD.19 9.1,36.62 10.6,36.62 11.48,35.75 11.48,34.24 v12.7,33.02
  Bottom 0.3: SDPIN5.1 25.38,21.75 24.38,22.75 15.35,22.75 12.7,25.4 v12.7,33.02
SDCMD
  Bottom 0.3: PORTBOARD.20 10.38,38 10.38,37 14.88,32.5 14.88,29.75 15.57,29.06 25.35,29.06 27.88,26.53 27.88,21.75 SDPIN3.1
SDDATA0  (via drill 0.35)
  Top 0.3: v16.63,21.75 13.88,21.75 5.88,29.75 5.88,41.5 7.38,43 PORTBOARD.15
  Bottom 0.3: v16.63,21.75 22.63,21.75 SDPIN7.1
SDDATA1  (via drill 0.35)
  Top 0.3: v19.88,39.25 21.38,37.75 21.38,24.25 SDPIN8.1
  Bottom 0.3: v19.88,39.25 14.13,39.25 10.38,43 PORTBOARD.16
SDDATA2  (via drill 0.35)
  Top 0.3: v17.38,21 17.38,22.5 13.88,22.5 6.38,30 6.38,39.5 7.38,40.5 PORTBOARD.17
  Bottom 0.3: v17.38,21 19.4,18.98 27.86,18.98 30.38,21.5 SDPIN1.1
SDDATA3  (via drill 0.35)
  Top 0.3: v22.13,34.25 26.63,29.75 26.63,24.25 SDPIN2.1
  Bottom 0.3: v22.13,34.25 18.88,34.25 15.13,38 12.88,38 10.38,40.5 PORTBOARD.18
TEENSY_L  (via drill 0.35)
  Top 0.3: C18.2 96.52,2.54 68.58,2.54 68.38,2.5 39.63,2.5 17.38,24.75 17.38,43.5 v18.13,44.25
  Bottom 0.3: v18.13,44.25 30.13,44.25 34.13,48.25 TEENSY_3.6.21/DAC0
TEENSY_R
  Top 0.3: TEENSY_3.6.A22/DAC1 34.38,50.75 35.38,49.75 35.38,42.75 34.38,41.75 33.88,41.75 33.13,41 33.13,30 54.24,8.89 76.2,8.89 C9.2
USBDATA+
  Top 0.3: PORTBOARD.13 7.38,45.75 5.38,47.75 5.38,89.2 7.18,91 20.13,91 23.5,87.63 USBPIN+.1
USBDATA-
  Top 0.3: PORTBOARD.14 10.13,45.5 8.88,46.75 8.88,47 7.13,47 5.88,48.25 5.88,88.94 7.44,90.5 19.88,90.5 23.85,86.53 25.73,86.53 26.83,87.63 USBPIN-.1
XPN_CLK  (via drill 0.35)
  Top 0.3: 57.13,76.96 57.13,78.75 58.38,80 XPN1.4 | 58.63,16.75 XPN8.4 57.13,17.8 57.13,27.94 | 58.63,26.5 XPN7.4 57.15,27.94 57.13,27.94 | 58.63,44.25 XPN5.4 57.15,45.72 57.13,45.72 | 57.13,54.75 57.13,63.5 | 57.13,54.75 58.38,53.5 XPN4.4 | 58.38,62 XPN3.4 57.15,63.5 57.13,63.5 | 57.13,54.75 57.13,45.72 | 57.13,45.72 57.13,36.83 | 57.13,36.83 57.13,27.94 | XPN6.4 57.15,36.83 57.13,36.83 | 57.13,76.96 57.13,72.39 | 57.13,72.39 57.13,63.5 | XPN2.4 58.4,71.12 57.13,72.39 | v52.74,75.25 55.42,75.25 57.13,76.96
  Bottom 0.3: TEENSY_3.6.20/A6 34.88,74.25 38.23,74.25 39.73,75.76 52.11,75.76 52.61,75.25 v52.74,75.25
XPN_CS1  (via drill 0.35)
  Top 0.3: XPN1.10 65.88,80.25 63.13,83 50.48,83 v50.04,83.44
  Bottom 0.3: TEENSY_3.6.6 18.88,71.25 17.13,73 17.13,83.68 18.32,84.87 48.6,84.87 v50.04,83.44
XPN_CS2  (via drill 0.35)
  Top 0.3: v23.02,50.87 23.02,51.89 29.13,58 29.13,85.25 33.88,90 61.09,90 v61.81,89.28
  Bottom 0.3: v23.02,50.87 19.08,50.87 TEENSY_3.6.24 | v61.81,89.28 64.88,86.21 64.88,72.25 65.88,71.25 XPN2.10
XPN_CS3  (via drill 0.35)
  Top 0.3: TEENSY_3.6.25 19.06,48.25 21.58,48.25 24.63,51.3 24.63,52.75 29.63,57.75 29.63,81.28 | 29.63,81.5 29.63,81.28 | 66.13,62.25 XPN3.10 | 29.63,81.28 29.68,81.33 29.68,81.44 33.1,84.86 34.72,84.86 35.38,84.2 63.63,84.2 67.13,80.7 67.13,76.25 v67.31,76.07
  Bottom 0.3: v67.31,76.07 67.31,63.5 XPN3.10
XPN_CS4  (via drill 0.35)
  Top 0.3: v25.38,51 30.13,55.75 30.13,81.25 31.25,82.37 63.04,82.37 64.63,80.79 64.63,73.53 v63.74,72.64
  Bottom 0.3: v25.38,51 20.1,45.72 TEENSY_3.6.26 | v63.74,72.64 64.77,71.61 64.77,54.61 XPN4.10
XPN_CS5  (via drill 0.35)
  Top 0.3: TEENSY_3.6.27 18.88,43 17.88,42 17.88,25 37.63,5.25 64.05,5.25 v65.28,6.48 | v65.66,10.79 65.66,11.05 67.31,12.7 67.31,17.78 64.72,20.37 64.72,43.13 XPN5.10
  Bottom 0.3: v65.66,10.79 65.66,6.86 v65.28,6.48
XPN_CS6  (via drill 0.35)
  Top 0.3: TEENSY_3.6.15/A1 34.13,60.75 32.63,59.25 32.63,44 32.88,43.75 32.88,41.5 32.63,41.25 32.63,29.5 51.59,10.54 51.63,10.54 v53.26,8.9
  Bottom 0.3: XPN6.10 66.13,35.5 67.13,35.5 67.13,13.5 62.53,8.9 v53.26,8.9
XPN_CS7  (via drill 0.35)
  Top 0.3: v51.9,9.23 30.63,30.5 30.63,62 34.88,62 35.38,61.5 35.38,59.5 34.38,58.5 TEENSY_3.6.14/A0
  Bottom 0.3: v51.9,9.23 52.28,9.61 60.74,9.61 64.88,13.75 64.88,26.5 65.88,26.5 XPN7.10
XPN_CS8  (via drill 0.35)
  Top 0.3: v38.72,78.77 50.77,78.77 51.86,77.68 51.86,22.27 57.13,17 57.13,16.25 58.13,15.25 64.63,15.25 65.88,16.5 XPN8.10
  Bottom 0.3: v38.72,78.77 38.72,78.64 34.39,78.64 TEENSY_3.6.22/A8
XPN_MISO  (via drill 0.35)
  Top 0.3: v37.38,75 37.48,75.1 37.48,79.28 39.95,81.75 61.88,81.75 62.29,81.34 | 62.29,81.34 63.38,80.25 XPN1.8 63.38,80 | 62.29,81.34 62.23,81.28 62.23,72.39 | 62.23,72.39 62.23,63.5 | 62.23,63.5 62.23,54.61 | 62.23,54.61 62.23,45.72 | 62.23,45.72 62.23,36.83 | 62.23,36.83 62.23,27.94 | 62.23,27.94 62.23,17.78 XPN8.8 | XPN7.8 62.23,27.94 | XPN6.8 62.23,36.83 | XPN5.8 62.23,45.72 | XPN4.8 62.23,54.61 | XPN3.8 62.23,63.5 | XPN2.8 62.23,72.39
  Bottom 0.3: v37.38,75 34.13,75 32.88,73.75 19.13,73.75 TEENSY_3.6.5
XPN_MOSI  (via drill 0.35)
  Top 0.3: v52.49,78.48 55.25,81.25 59.72,81.25 | 60.88,53.5 XPN4.6 60.96,53.37 59.72,54.61 | XPN1.6 59.72,81.25 | 59.72,81.25 59.72,72.39 | 59.72,72.39 59.72,63.5 | 59.72,63.5 59.72,54.61 | 59.72,54.61 59.72,45.72 | 59.72,45.72 59.72,36.83 | 59.72,36.83 59.72,27.94 | 59.72,27.94 59.72,17.75 XPN8.6 | XPN7.6 60.96,26.7 59.72,27.94 | XPN6.6 60.96,35.59 59.72,36.83 | XPN5.6 60.96,44.48 59.72,45.72 | XPN3.6 60.96,62.26 59.72,63.5 | XPN2.6 60.96,71.15 59.72,72.39
  Bottom 0.3: v52.49,78.48 50.25,76.25 34.38,76.25 TEENSY_3.6.21/A7

### Text on the board
tPlace: L Gain Adj | R Gain Adj | 9 Channel Stereo Audio Mixer | Lynxwave ButtSeqs - 2025 / Teensy Main Connection PCB